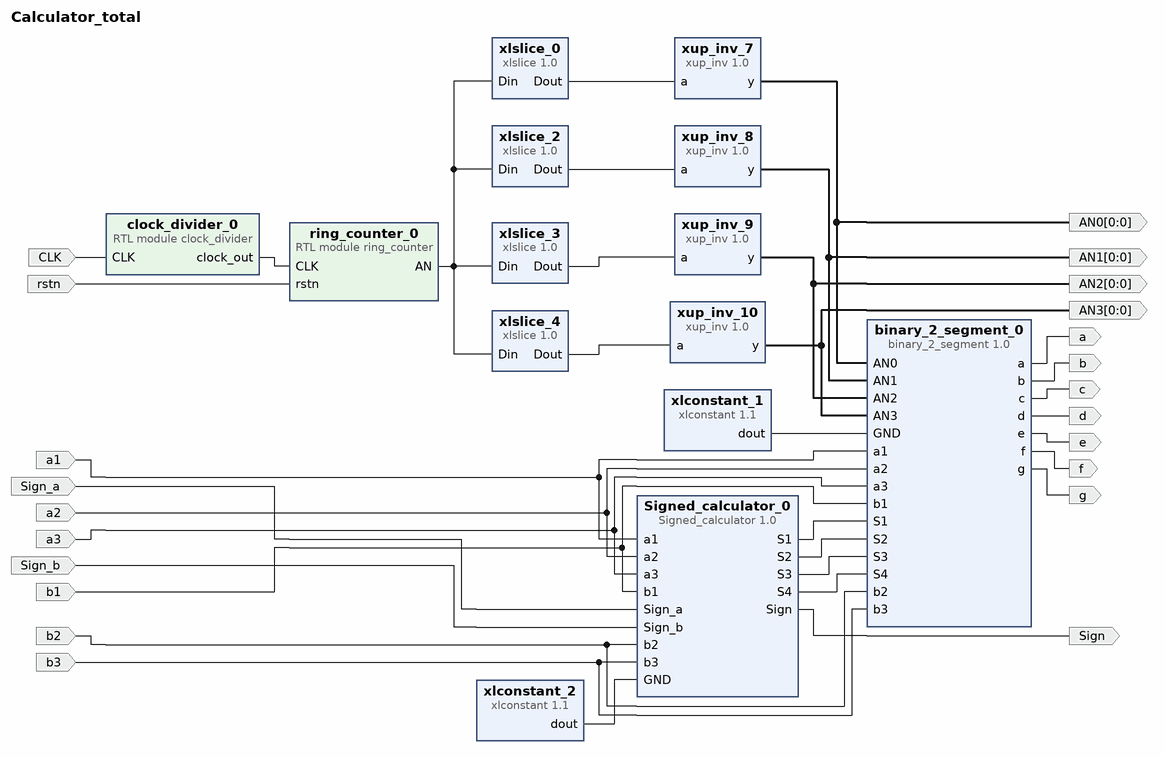
[diagram p0: block diagram of the top level]
# Vivado block design Calculator_total, xc7a35tcpg236-1, Vivado 2021.1
create_bd_design Calculator_total

create_bd_port -dir I CLK
create_bd_port -dir O Sign
create_bd_port -dir I Sign_a
create_bd_port -dir I Sign_b
create_bd_port -dir I a1
create_bd_port -dir I a2
create_bd_port -dir I a3
create_bd_port -dir I b1
create_bd_port -dir I b2
create_bd_port -dir I b3
create_bd_port -dir O a
create_bd_port -dir O b
create_bd_port -dir O c
create_bd_port -dir O d
create_bd_port -dir O e
create_bd_port -dir O f
create_bd_port -dir O g
create_bd_port -dir O -from 0 -to 0 AN0
create_bd_port -dir O -from 0 -to 0 AN1
create_bd_port -dir O -from 0 -to 0 AN2
create_bd_port -dir O -from 0 -to 0 AN3
create_bd_port -dir I -type rst rstn

create_bd_cell -type ip -vlnv xilinx.com:user:Signed_calculator:1.0 Signed_calculator_0
create_bd_cell -type ip -vlnv xilinx.com:ip:xlconstant:1.1 xlconstant_1
set_property -dict {CONFIG.CONST_VAL 0} [get_bd_cells xlconstant_1]
create_bd_cell -type ip -vlnv xilinx.com:ip:xlconstant:1.1 xlconstant_2
set_property -dict {CONFIG.CONST_VAL 0} [get_bd_cells xlconstant_2]
create_bd_cell -type ip -vlnv xilinx.com:ip:xlslice:1.0 xlslice_0
set_property -dict {CONFIG.DIN_WIDTH 4} [get_bd_cells xlslice_0]
create_bd_cell -type ip -vlnv xilinx.com:ip:xlslice:1.0 xlslice_2
set_property -dict {CONFIG.DIN_FROM 1 CONFIG.DIN_TO 1 CONFIG.DIN_WIDTH 4 CONFIG.DOUT_WIDTH 1} [get_bd_cells xlslice_2]
create_bd_cell -type ip -vlnv xilinx.com:ip:xlslice:1.0 xlslice_3
set_property -dict {CONFIG.DIN_FROM 2 CONFIG.DIN_TO 2 CONFIG.DIN_WIDTH 4 CONFIG.DOUT_WIDTH 1} [get_bd_cells xlslice_3]
create_bd_cell -type ip -vlnv xilinx.com:ip:xlslice:1.0 xlslice_4
set_property -dict {CONFIG.DIN_FROM 3 CONFIG.DIN_TO 3 CONFIG.DIN_WIDTH 4 CONFIG.DOUT_WIDTH 1} [get_bd_cells xlslice_4]
create_bd_cell -type ip -vlnv xilinx.com:xup:xup_inv:1.0 xup_inv_7
create_bd_cell -type ip -vlnv xilinx.com:xup:xup_inv:1.0 xup_inv_8
create_bd_cell -type ip -vlnv xilinx.com:xup:xup_inv:1.0 xup_inv_9
create_bd_cell -type ip -vlnv xilinx.com:xup:xup_inv:1.0 xup_inv_10
create_bd_cell -type module -reference ring_counter ring_counter_0
create_bd_cell -type ip -vlnv xilinx.com:user:binary_2_segment:1.0 binary_2_segment_0
create_bd_cell -type module -reference clock_divider clock_divider_0

# ---- connections ----

connect_bd_net [get_bd_ports CLK] [get_bd_pins clock_divider_0/CLK]
connect_bd_net [get_bd_ports Sign_a] [get_bd_pins Signed_calculator_0/Sign_a]
connect_bd_net [get_bd_ports Sign_b] [get_bd_pins Signed_calculator_0/Sign_b]
connect_bd_net [get_bd_pins Signed_calculator_0/S1] [get_bd_pins binary_2_segment_0/S1]
connect_bd_net [get_bd_pins Signed_calculator_0/S2] [get_bd_pins binary_2_segment_0/S2]
connect_bd_net [get_bd_pins Signed_calculator_0/S3] [get_bd_pins binary_2_segment_0/S3]
connect_bd_net [get_bd_pins Signed_calculator_0/S4] [get_bd_pins binary_2_segment_0/S4]
connect_bd_net [get_bd_pins Signed_calculator_0/Sign] [get_bd_ports Sign]
connect_bd_net -net a1_1 [get_bd_ports a1] [get_bd_pins Signed_calculator_0/a1] [get_bd_pins binary_2_segment_0/a1]
connect_bd_net -net a2_1 [get_bd_ports a2] [get_bd_pins Signed_calculator_0/a2] [get_bd_pins binary_2_segment_0/a2]
connect_bd_net -net a3_1 [get_bd_ports a3] [get_bd_pins Signed_calculator_0/a3] [get_bd_pins binary_2_segment_0/a3]
connect_bd_net -net b1_1 [get_bd_ports b1] [get_bd_pins Signed_calculator_0/b1] [get_bd_pins binary_2_segment_0/b1]
connect_bd_net -net b2_1 [get_bd_ports b2] [get_bd_pins Signed_calculator_0/b2] [get_bd_pins binary_2_segment_0/b2]
connect_bd_net -net b3_1 [get_bd_ports b3] [get_bd_pins Signed_calculator_0/b3] [get_bd_pins binary_2_segment_0/b3]
connect_bd_net [get_bd_pins binary_2_segment_0/a] [get_bd_ports a]
connect_bd_net [get_bd_pins binary_2_segment_0/b] [get_bd_ports b]
connect_bd_net [get_bd_pins binary_2_segment_0/c] [get_bd_ports c]
connect_bd_net [get_bd_pins binary_2_segment_0/d] [get_bd_ports d]
connect_bd_net [get_bd_pins binary_2_segment_0/e] [get_bd_ports e]
connect_bd_net [get_bd_pins binary_2_segment_0/f] [get_bd_ports f]
connect_bd_net [get_bd_pins binary_2_segment_0/g] [get_bd_ports g]
connect_bd_net [get_bd_pins clock_divider_0/clock_out] [get_bd_pins ring_counter_0/CLK]
connect_bd_net [get_bd_pins ring_counter_0/AN] \
  [get_bd_pins xlslice_0/Din] [get_bd_pins xlslice_2/Din] [get_bd_pins xlslice_3/Din] [get_bd_pins xlslice_4/Din]
connect_bd_net [get_bd_ports rstn] [get_bd_pins ring_counter_0/rstn]
connect_bd_net [get_bd_pins xlconstant_1/dout] [get_bd_pins binary_2_segment_0/GND]
connect_bd_net [get_bd_pins xlconstant_2/dout] [get_bd_pins Signed_calculator_0/GND]
connect_bd_net [get_bd_pins xlslice_0/Dout] [get_bd_pins xup_inv_7/a]
connect_bd_net [get_bd_pins xlslice_2/Dout] [get_bd_pins xup_inv_8/a]
connect_bd_net [get_bd_pins xlslice_3/Dout] [get_bd_pins xup_inv_9/a]
connect_bd_net [get_bd_pins xlslice_4/Dout] [get_bd_pins xup_inv_10/a]
connect_bd_net [get_bd_pins xup_inv_10/y] [get_bd_ports AN3] [get_bd_pins binary_2_segment_0/AN3]
connect_bd_net [get_bd_pins xup_inv_7/y] [get_bd_ports AN0] [get_bd_pins binary_2_segment_0/AN0]
connect_bd_net [get_bd_pins xup_inv_8/y] [get_bd_ports AN1] [get_bd_pins binary_2_segment_0/AN1]
connect_bd_net [get_bd_pins xup_inv_9/y] [get_bd_ports AN2] [get_bd_pins binary_2_segment_0/AN2]

validate_bd_design
save_bd_design
